# EAGLE design bbf-eurojacks (EAGLE 7.7.0)
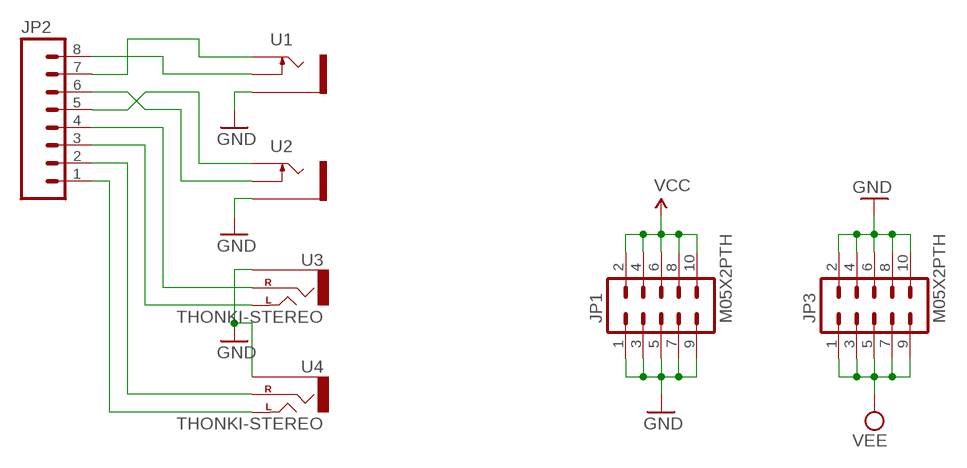
[diagram p0: schematic, sheet 1]

## Parts
JP1  M05X2PTH  [AVR_ICSP]
JP2  M08  [1X08]
JP3  M05X2PTH  [AVR_ICSP]
U1  THONKICONNNEW  [WQP-PJ301M-12_JACK]
U2  THONKICONNNEW  [WQP-PJ301M-12_JACK]
U3  THONKI-STEREO  [WQP-PJ366ST_JACK]
U4  THONKI-STEREO  [WQP-PJ366ST_JACK]

## Nets
2-SWITCH: JP2.6 U2.P$2_SWITCH(SWITCH)
2-TIP: JP2.5 U2.P$1_TIP(TIP)
3-LEFT: JP2.3 U3.P$1_TIP(LEFT)
3-RIGHT: JP2.4 U3.P$2_SWITCH(RIGHT)
4-LEFT: JP2.1 U4.P$1_TIP(LEFT)
4-RIGHT: JP2.2 U4.P$2_SWITCH(RIGHT)
GND: JP1.1 JP1.3 JP1.5 JP1.7 JP1.9 JP3.2 JP3.4 JP3.6 JP3.8 JP3.10 U1.P$3_SLEEVE(SLEEVE) U2.P$3_SLEEVE(SLEEVE) U3.P$3_SLEEVE(SLEEVE) U4.P$3_SLEEVE(SLEEVE)
N$1: JP2.8 U1.P$2_SWITCH(SWITCH)
N$2: JP2.7 U1.P$1_TIP(TIP)
VCC: JP1.2 JP1.4 JP1.6 JP1.8 JP1.10
VEE: JP3.1 JP3.3 JP3.5 JP3.7 JP3.9

## Library data of the parts
JP1 JP3 = SparkFun:M05X2: Header 5x2 Standard 10-pin dual row 0.1" header. Commonly used with AVR-ISP. Use with Spark Fun Electronics SKU: PRT-00778
JP2 = SparkFun:M08: Header 8 Standard 8-pin 0.1" header. Use with straight break away headers (SKU : PRT-00116), right angle break away headers (PRT-00553), swiss pins (PRT-00743), machine pins (PRT-00117), and female headers (PRT-00115).
U1 U2 = MusicThingModular:THONKICONN: 3.5mm socket for Eurorack modular synths
U3 U4 = MusicThingModular:THONKI-STEREO: 3.5mm socket for Eurorack modular synths

## Board
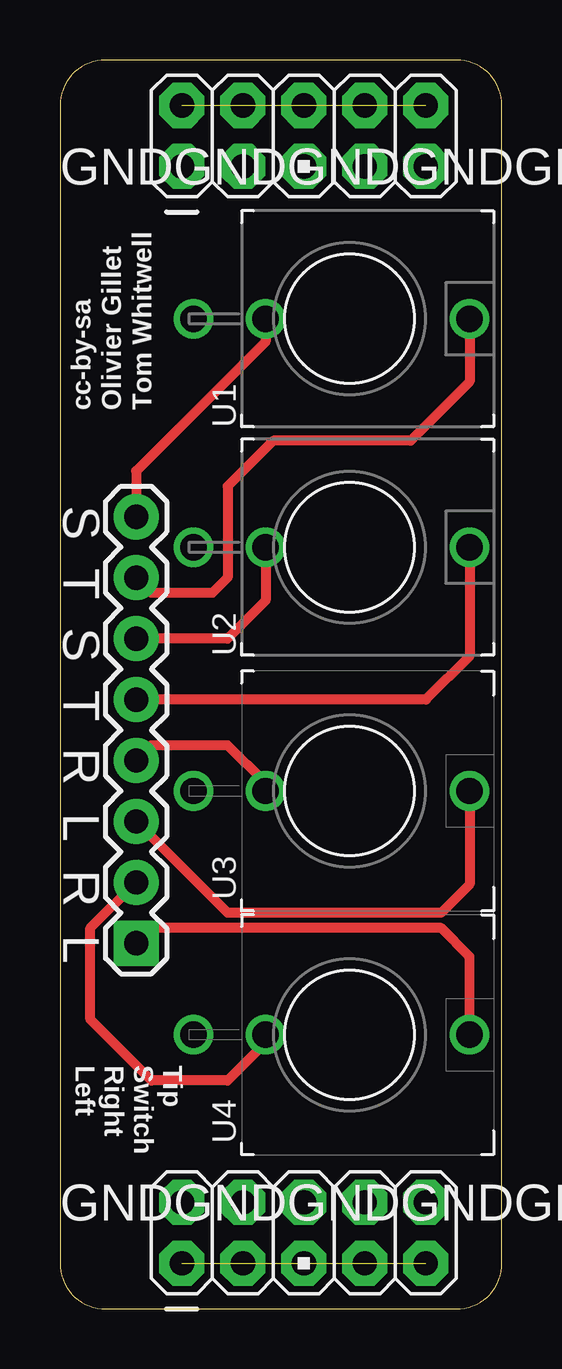
[diagram p1: board, top side]
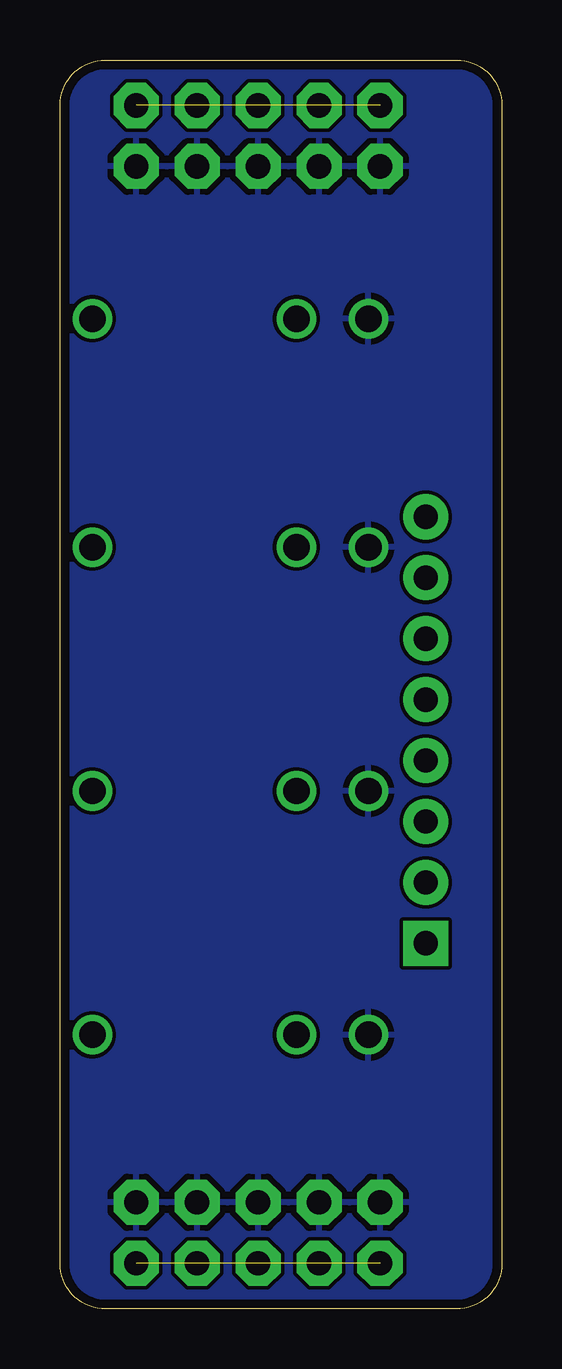
[diagram p2: board, bottom side, seen from below]

Size 18.41 x 52.06 mm. Coordinates in mm from the lower left corner, seen from the top.
Outline: 16.51,0 arc90 18.41,1.91 18.41,50.16 arc90 16.52,52.06 1.89,52.06 arc90 0,50.16 0,1.91 arc90 1.91,0 16.51,0
Copper layers (1*16): Top 0.0356mm / dielectric 1.5011mm / Bottom 0.0356mm
Design rules "oshpark-2layer": minimum track width 6mil, minimum drill 13mil, track to track 6mil, track to pad 6mil, pad to pad 6mil, via to via 6mil, smd to smd 6mil, copper to edge 15mil, drill to drill 6mil, minimum pad ring 7mil, minimum via ring 7mil, stop-mask expansion 2.5mil, vias tented up to drill 0mil, thermal gap 10mil

### Footprints (pad centres in the part's own frame; a part is rotated, then mirrored left to right if it is on the bottom)
AVR_ICSP = drill 1.016 pad 1.88 octagon: 1 -1.27,5.08; 2 1.27,5.08; 3 -1.27,2.54; 4 1.27,2.54; 5 -1.27,0; 6 1.27,0; 7 -1.27,-2.54; 8 1.27,-2.54; 9 -1.27,-5.08; 10 1.27,-5.08
1X08 = drill 1.016 pad 1.88 square: 1 0,0 | drill 1.016 pad 1.88: 2 2.54,0; 3 5.08,0; 4 7.62,0; 5 10.16,0; 6 12.7,0; 7 15.24,0; 8 17.78,0
WQP-PJ301M-12_JACK = drill 1.1: P$1_TIP 0,5; P$2_SWITCH 0,-3.5; P$3_SLEEVE 0,-6.5
WQP-PJ366ST_JACK = drill 1.1: P$1_TIP 0,5; P$2_SWITCH 0,-3.5; P$3_SLEEVE 0,-6.5

### Placement (x,y rotation side)
JP1  10.16,48.9 90 top
JP2  3.17,15.24 90 top
JP3  10.16,3.17 90 top
U1  12.06,41.27 270 top
U2  12.06,31.75 270 top
U3  12.06,21.59 270 top
U4  12.06,11.43 270 top

### Tracks (layer width: path | path; a pad name or v marks a point on that pad's centre or on a via)
2-SWITCH
  Top 0.406: U2.P$2_SWITCH 8.56,29.52 6.99,27.94 JP2.6
2-TIP
  Top 0.406: U2.P$1_TIP 17.06,27.22 15.24,25.4 JP2.5
3-LEFT
  Top 0.406: U3.P$1_TIP 17.06,17.7 15.88,16.51 6.99,16.51 JP2.3
3-RIGHT
  Top 0.406: U3.P$2_SWITCH 8.56,21.91 6.99,23.49 3.81,23.49 JP2.4
4-LEFT
  Top 0.406: U4.P$1_TIP 17.06,14.69 15.88,15.88 3.81,15.88 JP2.1
4-RIGHT
  Top 0.406: U4.P$2_SWITCH 8.56,11.11 6.99,9.53 3.81,9.53 1.27,12.06 1.27,15.88 JP2.2
GND
  pour Bottom: 16.51,0 arc90 18.41,1.91 18.41,50.16 arc90 16.51,52.07 1.91,52.07 arc90 0,50.16 0,1.91 arc90 1.91,0
N$1
  Top 0.406: U1.P$2_SWITCH 8.56,40.32 3.17,34.93 JP2.8
N$2
  Top 0.406: U1.P$1_TIP 17.06,38.66 14.61,36.2 8.89,36.2 6.99,34.29 6.99,30.48 6.35,29.84 3.81,29.84 JP2.7
VCC  (4 unrouted)
VEE  (4 unrouted)

### Text on the board
tPlace: GNDGNDGNDGNDGND | S | T | S | T | R | L | R | L | GNDGNDGNDGNDGND
tNames: cc-by-sa | Olivier Gillet | Tom Whitwell | Tip / Switch / Right / Left